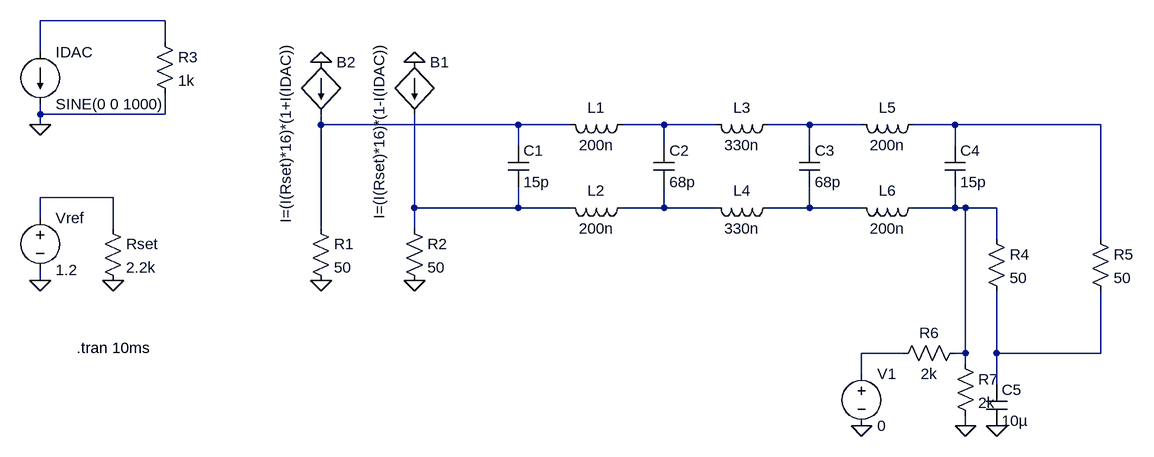
[diagram p0: schematic IQDDS.asc]
IQDDS.asc, the LTspice schematic file:
Version 4
SHEET 1 1316 680
WIRE -192 -160 -384 -160
WIRE -192 -128 -192 -160
WIRE -384 -112 -384 -160
WIRE -384 -16 -384 -32
WIRE -192 -16 -192 -48
WIRE -192 -16 -384 -16
WIRE -384 0 -384 -16
WIRE 48 0 48 -16
WIRE 352 0 48 0
WIRE 432 0 352 0
WIRE 576 0 512 0
WIRE 656 0 576 0
WIRE 800 0 736 0
WIRE 880 0 800 0
WIRE 1024 0 960 0
WIRE 1248 0 1024 0
WIRE 352 32 352 0
WIRE 576 32 576 0
WIRE 800 32 800 0
WIRE 1024 32 1024 0
WIRE -272 112 -384 112
WIRE 192 128 192 -16
WIRE 352 128 352 96
WIRE 352 128 192 128
WIRE 432 128 352 128
WIRE 576 128 576 96
WIRE 576 128 512 128
WIRE 656 128 576 128
WIRE 800 128 800 96
WIRE 800 128 736 128
WIRE 880 128 800 128
WIRE 1024 128 1024 96
WIRE 1024 128 960 128
WIRE 1040 128 1024 128
WIRE 1088 128 1040 128
WIRE -384 144 -384 112
WIRE -272 160 -272 112
WIRE 48 160 48 0
WIRE 192 160 192 128
WIRE 1088 176 1088 128
WIRE 1248 176 1248 0
WIRE -384 240 -384 224
WIRE 944 352 880 352
WIRE 1040 352 1040 128
WIRE 1040 352 1024 352
WIRE 1088 352 1088 256
WIRE 1248 352 1248 256
WIRE 1248 352 1088 352
WIRE 1040 368 1040 352
WIRE 880 384 880 352
WIRE 1088 400 1088 352
WIRE 1040 464 1040 448
FLAG 48 240 0
FLAG 192 240 0
FLAG -272 240 0
FLAG -384 240 0
FLAG 48 -96 0
FLAG 192 -96 0
FLAG -384 0 0
FLAG 1088 464 0
FLAG 880 464 0
FLAG 1040 464 0
SYMBOL res 32 144 R0
SYMATTR InstName R1
SYMATTR Value 50
SYMBOL res 176 144 R0
SYMATTR InstName R2
SYMATTR Value 50
SYMBOL res -288 144 R0
SYMATTR InstName Rset
SYMATTR Value 2.2k
SYMBOL voltage -384 128 R0
SYMATTR InstName Vref
SYMATTR Value 1.2
SYMBOL bi 48 -96 R0
WINDOW 3 -54 -32 VRight 2
SYMATTR InstName B2
SYMATTR Value I=(I(Rset)*16)*(1+I(IDAC))
SYMBOL current -384 -112 R0
WINDOW 123 0 0 Left 0
WINDOW 39 0 0 Left 0
SYMATTR InstName IDAC
SYMATTR Value SINE(0 0 1000)
SYMBOL bi 192 -96 R0
WINDOW 3 -54 -32 VRight 2
SYMATTR InstName B1
SYMATTR Value I=(I(Rset)*16)*(1-I(IDAC))
SYMBOL res -208 -144 R0
SYMATTR InstName R3
SYMATTR Value 1k
SYMBOL cap 336 32 R0
SYMATTR InstName C1
SYMATTR Value 15p
SYMBOL ind 528 -16 R90
WINDOW 0 5 56 VBottom 2
WINDOW 3 32 56 VTop 2
SYMATTR InstName L1
SYMATTR Value 200n
SYMBOL ind 528 112 R90
WINDOW 0 5 56 VBottom 2
WINDOW 3 32 56 VTop 2
SYMATTR InstName L2
SYMATTR Value 200n
SYMBOL cap 560 32 R0
SYMATTR InstName C2
SYMATTR Value 68p
SYMBOL ind 752 -16 R90
WINDOW 0 5 56 VBottom 2
WINDOW 3 32 56 VTop 2
SYMATTR InstName L3
SYMATTR Value 330n
SYMBOL ind 752 112 R90
WINDOW 0 5 56 VBottom 2
WINDOW 3 32 56 VTop 2
SYMATTR InstName L4
SYMATTR Value 330n
SYMBOL cap 784 32 R0
SYMATTR InstName C3
SYMATTR Value 68p
SYMBOL ind 976 -16 R90
WINDOW 0 5 56 VBottom 2
WINDOW 3 32 56 VTop 2
SYMATTR InstName L5
SYMATTR Value 200n
SYMBOL ind 976 112 R90
WINDOW 0 5 56 VBottom 2
WINDOW 3 32 56 VTop 2
SYMATTR InstName L6
SYMATTR Value 200n
SYMBOL cap 1008 32 R0
SYMATTR InstName C4
SYMATTR Value 15p
SYMBOL res 1072 160 R0
SYMATTR InstName R4
SYMATTR Value 50
SYMBOL res 1232 160 R0
SYMATTR InstName R5
SYMATTR Value 50
SYMBOL res 1040 336 R90
WINDOW 0 0 56 VBottom 2
WINDOW 3 32 56 VTop 2
SYMATTR InstName R6
SYMATTR Value 2k
SYMBOL cap 1072 400 R0
SYMATTR InstName C5
SYMATTR Value 10µ
SYMBOL voltage 880 368 R0
WINDOW 123 0 0 Left 0
WINDOW 39 0 0 Left 0
SYMATTR InstName V1
SYMATTR Value 0
SYMBOL res 1024 352 R0
SYMATTR InstName R7
SYMATTR Value 2k
TEXT -328 344 Left 2 !.tran 10ms

The netlist it stands for:
* IQDDS.asc
R1 N002 0 50
R2 N007 0 50
Rset N006 0 2.2k
Vref N006 0 1.2
B2 0 N002 I=(I(Rset)*16)*(1+I(IDAC))
IDAC N001 0 SINE(0 0 1000)
B1 0 N007 I=(I(Rset)*16)*(1-I(IDAC))
R3 N001 0 1k
C1 N002 N007 15p
L1 N003 N002 200n
L2 N008 N007 200n
C2 N003 N008 68p
L3 N004 N003 330n
L4 N009 N008 330n
C3 N004 N009 68p
L5 N005 N004 200n
L6 N010 N009 200n
C4 N005 N010 15p
R4 N010 N012 50
R5 N005 N012 50
R6 N010 N011 2k
C5 N012 0 10µ
V1 N011 0 0
R7 N010 0 2k
.tran 10ms
.backanno
.end